# EAGLE design UVBox-I2C (EAGLE 7.5.0)
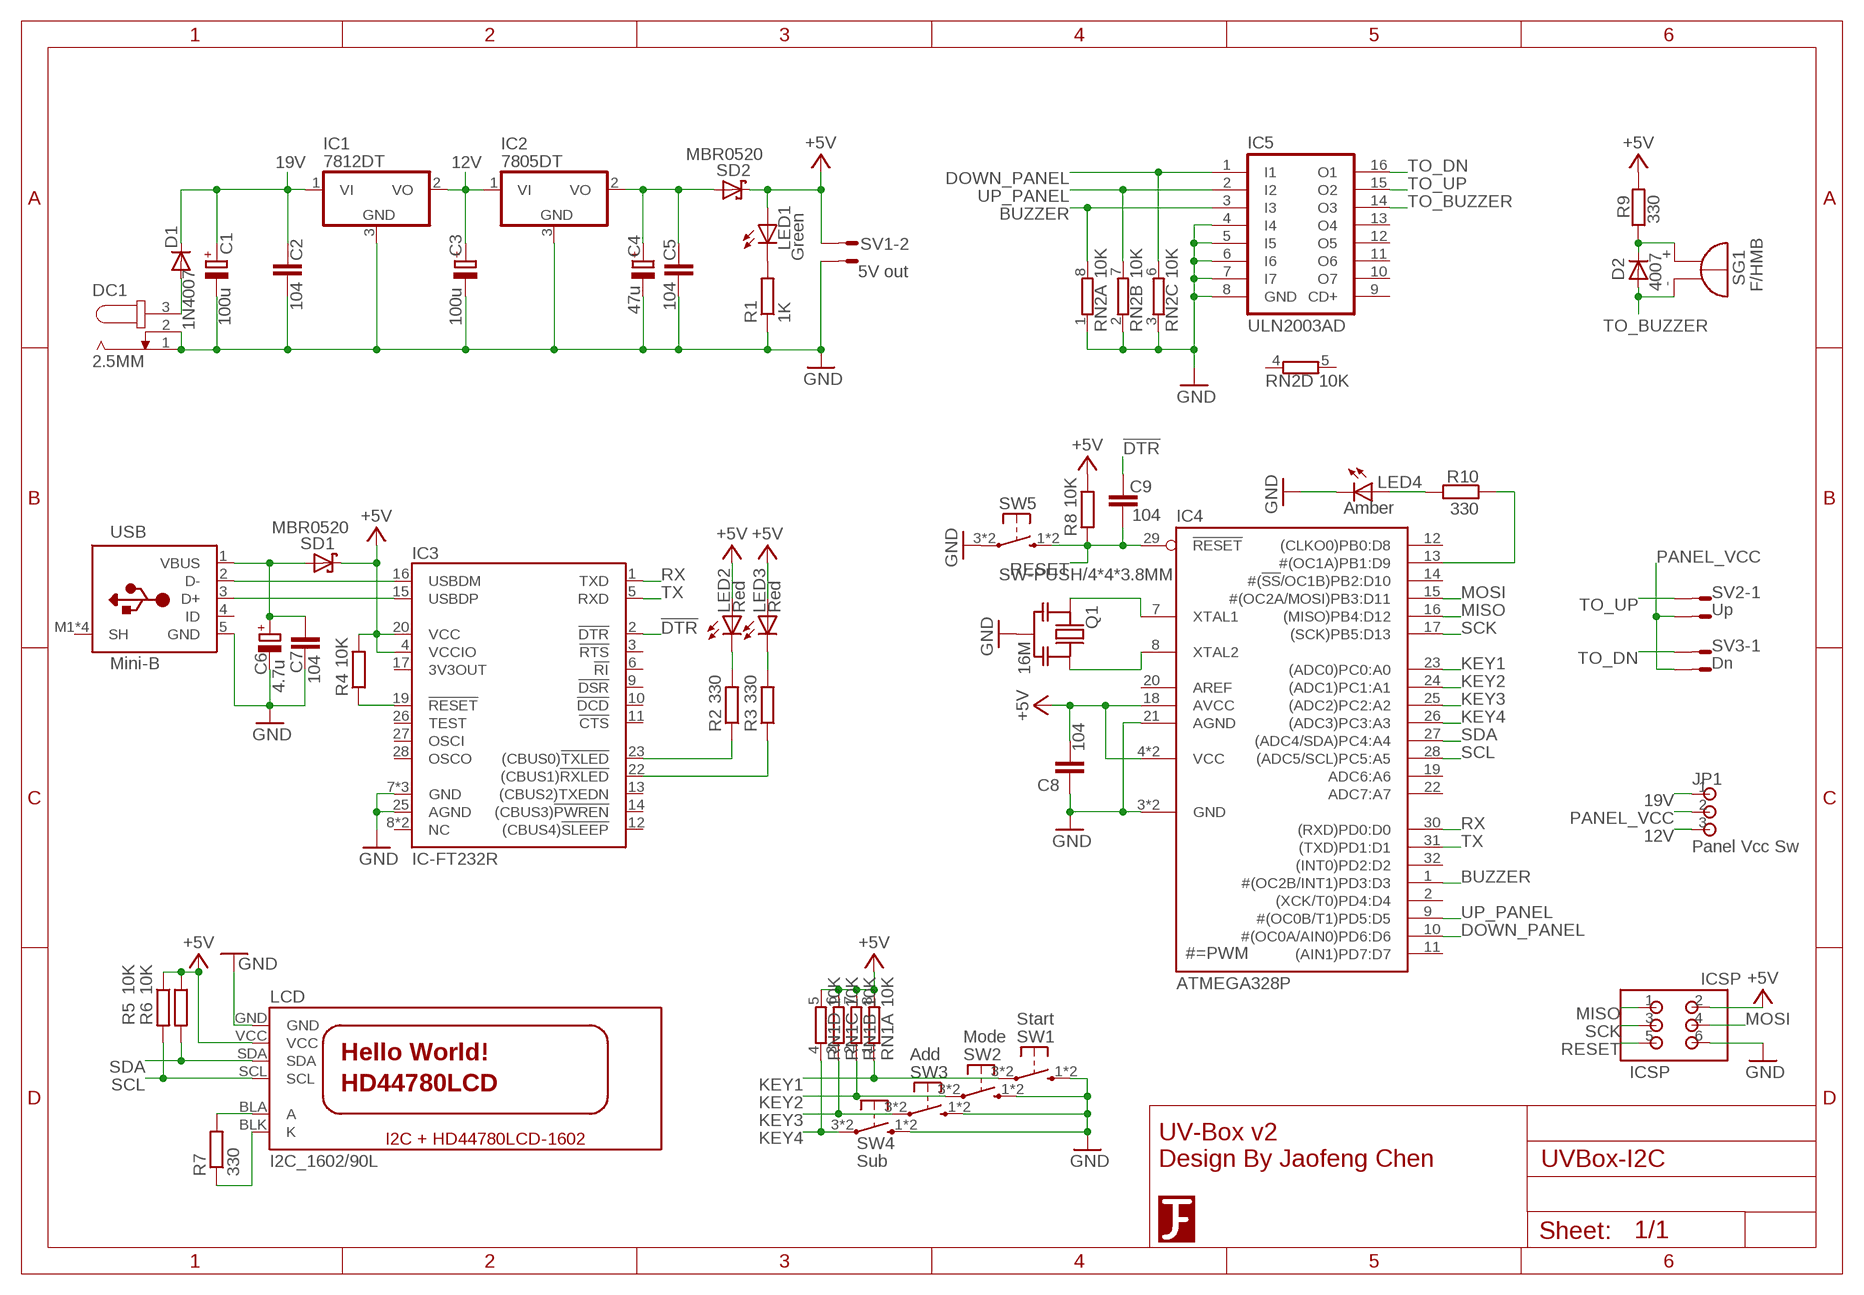
[diagram p0: schematic, sheet 1]

## Parts
C1  100u  CPOL-EU140CLH-0810  [140CLH-0810]
C2  104  C-EUC0805  [C0805]
C3  100u  CPOL-EUSMCC  [SMC_C]
C4  47u  CPOL-EUSMCC  [SMC_C]
C5  104  C-EUC0805  [C0805]
C6  4.7u  CPOL-EUSMCC  [SMC_C]
C7  104  C-EUC0805  [C0805]
C8  104  C-EUC0805  [C0805]
C9  104  C-EUC0805  [C0805]
D1  1N4007  DIODE-DO-214AC  [DO-214AC]
D2  4007  DIODE-DO214AA  [DO214AA]
DC1  2.5MM  DC-JACK/2.5MM  [SPC4078]
IC1  7812DT  [TO252]
IC2  7805DT  [TO252]
IC3  IC-FT232R  [SSOP28]
IC4  ATMEGA328P  ATMEGA328P-TQFP32  [TQFP32]
IC5  ULN2003AD  [SO16]
ICSP  ICSP  PIN-2X3/2.54-DIP  [DIP-2.54-2X3]
JP1  Panel Vcc Sw  PIN-1X3-2.0  [DIP-2.0-1X3]
LCD  I2C_1602/90L  [I2C_1602/90L]
LED1  Green  LEDCHIPLED_1206  [CHIPLED_1206]
LED2  Red  LEDCHIPLED_1206  [CHIPLED_1206]
LED3  Red  LEDCHIPLED_1206  [CHIPLED_1206]
LED4  Amber  LEDCHIPLED_1206  [CHIPLED_1206]
Q1  16M  CERMOSCILL-CSTCE  [CSTCE]
R1  1K  R-EU_R0805  [R0805]
R2  330  R-EU_R0805  [R0805]
R3  330  R-EU_R0805  [R0805]
R4  10K  R-EU_R0805  [R0805]
R5  10K  R-EU_R0805  [R0805]
R6  10K  R-EU_R0805  [R0805]
R7  330  R-EU_R0805  [R0805]
R8  10K  R-EU_R0805  [R0805]
R9  330  R-EU_R0805  [R0805]
R10  330  R-EU_R0805  [R0805]
RN1  10K  RN4R-CAY16  [CAY16]
RN2  10K  RN4R-CAY16  [CAY16]
SD1  MBR0520  SCHOTTKY  [SOD123]
SD2  MBR0520  SCHOTTKY  [SOD123]
SG1  F/HMB  [F/HMB]
SV1  5V out  L02P  [L02P]
SV2  Up  L02P  [L02P]
SV3  Dn  L02P  [L02P]
SW1  Start  SW-PUSH/6*6*3.8MM  [SW-6*6*3.8MM]
SW2  Mode  SW-PUSH/6*6*3.8MM  [SW-6*6*3.8MM]
SW3  Add  SW-PUSH/6*6*3.8MM  [SW-6*6*3.8MM]
SW4  Sub  SW-PUSH/6*6*3.8MM  [SW-6*6*3.8MM]
SW5  SW-PUSH/4*4*3.8MM  [SW-4*4*3.8MM]
U$2  LOGO-3  [LOGO-3]
USB  Mini-B  USB-MINI-B/NO_HOLE  [USB-MINI-B(NO_HOLE)]

## Nets
12V: C3.+ IC1.2(VO) IC2.1(VI) JP1.3
19V: C1.+ C2.1 D1.C IC1.1(VI) JP1.1
!DTR: C9.2 IC3.2(!DTR)
+5V: C8.2 IC3.4(VCCIO) IC3.20(VCC) IC4.4(VCC) IC4.6(VCC) IC4.18(AVCC) ICSP.2 LCD.VCC LED1.A LED2.A LED3.A R4.2 R5.1 R6.1 R8.2 R9.2 RN1.5 RN1.6 RN1.7 RN1.8 SD1.K SD2.K SV1.2
BUZZER: IC4.1(#(OC2B/INT1)PD3:D3) IC5.3(I3) RN2.8
DOWN_PANEL: IC4.10(#(OC0A/AIN0)PD6:D6) IC5.1(I1) RN2.6
GND: C1.- C2.2 C3.- C4.- C5.2 C6.- C7.2 C8.1 DC1.1 DC1.2 IC1.3(GND) IC2.3(GND) IC3.7(GND) IC3.18(GND) IC3.21(GND) IC3.25(AGND) IC4.3(GND) IC4.5(GND) IC4.21(AGND) IC5.4(I4) IC5.5(I5) IC5.6(I6) IC5.7(I7) IC5.8(GND) ICSP.6 LCD.GND LED4.C Q1.2(GND) R1.1 RN2.1 RN2.2 RN2.3 SV1.1 SW1.1(S) SW1.2(S) SW2.1(S) SW2.2(S) SW3.1(S) SW3.2(S) SW4.1(S) SW4.2(S) SW5.3(P) SW5.4(P) USB.5(GND)
KEY1: IC4.23((ADC0)PC0:A0) RN1.1 SW1.3(P) SW1.4(P)
KEY2: IC4.24((ADC1)PC1:A1) RN1.2 SW2.3(P) SW2.4(P)
KEY3: IC4.25((ADC2)PC2:A2) RN1.3 SW3.3(P) SW3.4(P)
KEY4: IC4.26((ADC3)PC3:A3) RN1.4 SW4.3(P) SW4.4(P)
MISO: IC4.16((MISO)PB4:D12) ICSP.1
MOSI: IC4.15(#(OC2A/MOSI)PB3:D11) ICSP.4
N$2: C6.+ C7.1 SD1.A USB.1(VBUS)
N$3: C4.+ C5.1 IC2.2(VO) SD2.A
N$4: D1.A DC1.3
N$5: IC3.19(!RESET) R4.1
N$9: IC4.7(XTAL1) Q1.1(IN)
N$10: LED1.C R1.2
N$11: IC3.16(USBDM) USB.2(D-)
N$12: LCD.BLK(K) R7.1
N$14: LCD.BLA(A) R7.2
N$15: IC3.15(USBDP) USB.3(D+)
N$16: LED2.C R2.2
N$17: LED3.C R3.2
N$18: D2.C R9.1 SG1.+
N$19: IC3.23((CBUS0)!TXLED) R2.1
N$20: IC3.22((CBUS1)!RXLED) R3.1
N$21: LED4.A R10.2
N$22: IC4.13(#(OC1A)PB1:D9) R10.1
N$61: IC4.8(XTAL2) Q1.3(OUT)
PANEL_VCC: JP1.2 SV2.2 SV3.2
RESET: C9.1 IC4.29(!RESET) ICSP.5 R8.1 SW5.1(S) SW5.2(S)
RX: IC3.1(TXD) IC4.30((RXD)PD0:D0)
SCK: IC4.17((SCK)PB5:D13) ICSP.3
SCL: IC4.28((ADC5/SCL)PC5:A5) LCD.SCL R5.2
SDA: IC4.27((ADC4/SDA)PC4:A4) LCD.SDA R6.2
TO_BUZZER: D2.A IC5.14(O3) SG1.-
TO_DN: IC5.16(O1) SV3.1
TO_UP: IC5.15(O2) SV2.1
TX: IC3.5(RXD) IC4.31((TXD)PD1:D1)
UP_PANEL: IC4.9(#(OC0B/T1)PD5:D5) IC5.2(I2) RN2.7
Unconnected: IC3.3(!RTS) IC3.6(!RI) IC3.8(NC) IC3.9(!DSR) IC3.10(!DCD) IC3.11(!CTS) IC3.12((CBUS4)!SLEEP) IC3.13((CBUS2)TXEDN) IC3.14((CBUS3)!PWREN) IC3.17(3V3OUT) IC3.24(NC) IC3.26(TEST) IC3.27(OSCI) IC3.28(OSCO) IC4.2((XCK/T0)PD4:D4) IC4.11((AIN1)PD7:D7) IC4.12((CLKO0)PB0:D8) IC4.14(#(!SS!/OC1B)PB2:D10) IC4.19(ADC6:A6) IC4.20(AREF) IC4.22(ADC7:A7) IC4.32((INT0)PD2:D2) IC5.9(CD+) IC5.10(O7) IC5.11(O6) IC5.12(O5) IC5.13(O4) RN2.4 RN2.5 USB.4(ID) USB.M1(SH) USB.M2(SH) USB.M3(SH) USB.M4(SH)

## Notes on the sheet
- UV-Box v2
  Design By Jaofeng Chen

## Library data of the parts
C1 C3 C4 C6 = rcl:CPOL-EU: POLARIZED CAPACITOR, European symbol
C2 C5 C7-C9 = rcl:C-EU: CAPACITOR, European symbol
D1 D2 = diode:DIODE-: DIODE
DC1 = 0_MyCustom:DC-JACK: DC 電源插座 Power Jack, DC, Right Angle, Through Hole, Rated 5A at 16VDC, PC Terminals Distributor: Farnell (www.Farnell.de) Drawing: 84N1161.pdf / 84N1162.pdf Manufacturer: SPC Technology (www.spctechnology.com) Type: SPC4077(2mm) / SPC 4078(2.5mm)
IC1 IC2 = linear:78*: Positive VOLTAGE REGULATOR Source: http://cache.national.com/ds/LM/LM78L05.pdf http://www.fairchildsemi.com/ds/LM/LM7805.pdf
IC3 = 0_MyCustom:IC-FT232R: FTDI FT232R
IC4 = 0_MyCustom:ATMEGA*-TQFP32: Atmel® AVR® 8-bit Microcontroller with 4/8/16/32KBytes In- System Programmable Flash Device Flash EEPROM RAM Max Speed Power ATmega8 8KBytes 512Bytes 1KBytes 0~16MHz 4.5V~5.5V ATmega8A 8KBytes 512Bytes 1KBytes 0~16MHz 2.7V~5.5V ATmega8L 8KBytes 512Bytes 1KBytes 0~8MHz 2.7V~5.5V ATmega48A 4KBytes 256Bytes 512Bytes 0~20MHz 1.8V~5.5V ATmega48PA 4KBytes 256Bytes 512Bytes 0~20MHz 1.8V~5.5V ATmega88A 8KBytes 512Bytes 1KBytes 0~20MHz 1.8V~5.5V ATmega88PA 8KBytes 512Bytes 1KBytes 0~20MHz 1.8V~5.5V ATmega168A 16KBytes 512Bytes 1KBytes 0~20MHz 1.8V~5.5V ATmega168PA 16KBytes 512Bytes 1KBytes 0~20MHz 1.8V~5.5V ATmega328 32KBytes 1KBytes 2KBytes 0~20MHz 1.8V~5.5V ATmega328P 32KBytes 1KBytes 2KBytes 0~20MHz 1.8V~5.5V
IC5 = uln-udn:ULN2003A: DRIVER ARRAY
ICSP = 0_MyCustom:PIN-2X3
JP1 = 0_MyCustom:PIN-1X3; PIN1: 19v; PIN3: 12v
LCD = 0_MyCustom:I2C_1602: HD44780 1602 + I2C 模組
LED1-LED4 = led:LED: LED OSRAM: - CHIPLED LG R971, LG N971, LY N971, LG Q971, LY Q971, LO R971, LY R971 LH N974, LH R974 LS Q976, LO Q976, LY Q976 LO Q996 - Hyper CHIPLED LW Q18S LB Q993, LB Q99A, LB R99A - SideLED LS A670, LO A670, LY A670, LG A670, LP A670 LB A673, LV A673, LT A673, LW A673 LH A674 LY A675 LS A676, LA A676, LO A676, LY A676, LW A676 LS A679, LY A679, LG A679 - Hyper Micro SIDELED® LS Y876, LA Y876, LO Y876, LY Y876 LT Y87S - SmartLED LW L88C, LW L88S LB L89C, LB L89S, LG L890 LS L89K, LO L89K, LY L89K LS L896, LA L896, LO L896, LY L896 - TOPLED LS T670, LO T670, LY T670, LG T670, LP T670 LSG T670, LSP T670, LSY T670, LOP T670, LYG T670 LG T671, LOG T671, LSG T671 LB T673, LV T673, LT T673, LW T673 LH T674 LS T676, LA T676, LO T676, LY T676, LB T676, LH T676, LSB T676, LW T676 LB T67C, LV T67C, LT T67C, LS T67K, LO T67K, LY T67K, LW E67C LS E67B, LA E67B, LO E67B, LY E67B, LB E67C, LV E67C, LT E67C LW T67C LS T679, LY T679, LG T679 LS T770, LO T770, LY T770, LG T770, LP T770 LB T773, LV T773, LT T773, LW T773 LH T774 LS E675, LA E675, LY E675, LS T675 LS T776, LA T776, LO T776, LY T776, LB T776 LHGB T686 LT T68C, LB T68C - Hyper Mini TOPLED® LB M676 - Mini TOPLED Santana® LG M470 LS M47K, LO M47K, LY M47K Source: http://www.osram.convergy.de LUXEON: - LUMILED® LXK2-PW12-R00, LXK2-PW12-S00, LXK2-PW14-U00, LXK2-PW14-V00 LXK2-PM12-R00, LXK2-PM12-S00, LXK2-PM14-U00 LXK2-PE12-Q00, LXK2-PE12-R00, LXK2-PE12-S00, LXK2-PE14-T00, LXK2-PE14-U00 LXK2-PB12-K00, LXK2-PB12-L00, LXK2-PB12-M00, LXK2-PB14-N00, LXK2-PB14-P00, LXK2-PB14-Q00 LXK2-PR12-L00, LXK2-PR12-M00, LXK2-PR14-Q00, LXK2-PR14-R00 LXK2-PD12-Q00, LXK2-PD12-R00, LXK2-PD12-S00 LXK2-PH12-R00, LXK2-PH12-S00 LXK2-PL12-P00, LXK2-PL12-Q00, LXK2-PL12-R00 Source: www.luxeon.com KINGBRIGHT: KA-3528ASYC Source: www.kingbright.com
Q1 = 0_MyCustom:CERMOSCILL
R1-R10 = rcl:R-EU_: RESISTOR, European symbol
RN1 RN2 = 0_MyCustom:RN4R: B型排阻 8P4R
SD1 SD2 = 0_MyCustom:SCHOTTKY
SG1 = buzzer:F/HMB: BUZZER Source: Buerklin; OC_FARNELL: unknown; OC_NEWARK: unknown
SV1-SV3 = con-amp-mt:L02P: AMP MT CONNECTOR; OC_FARNELL: unknown; OC_NEWARK: unknown
SW1-SW5 = 0_MyCustom:SW-PUSH: 無段式開關
U$2 = 0_MyCustom:LOGO-3
USB = 0_MyCustom:USB-MINI-B

## Net classes
0 default: clearance 0.205 mm

## Board
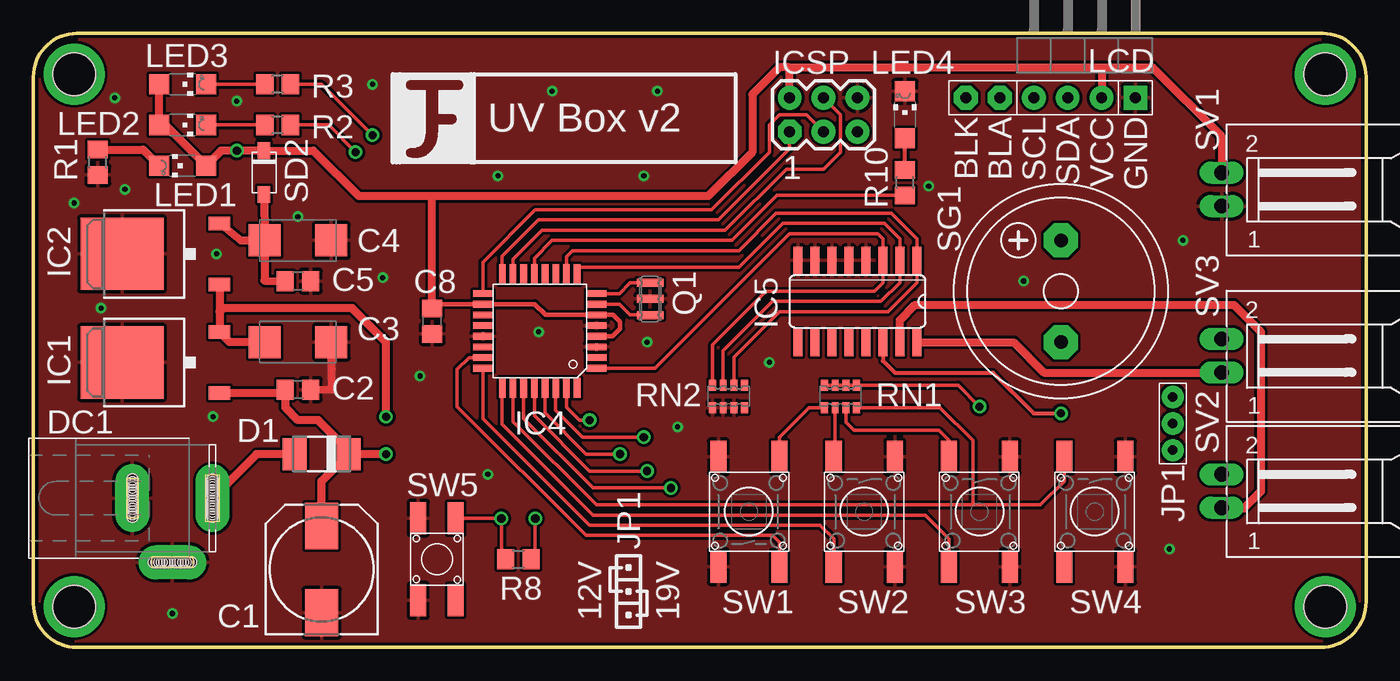
[diagram p1: board, top side]
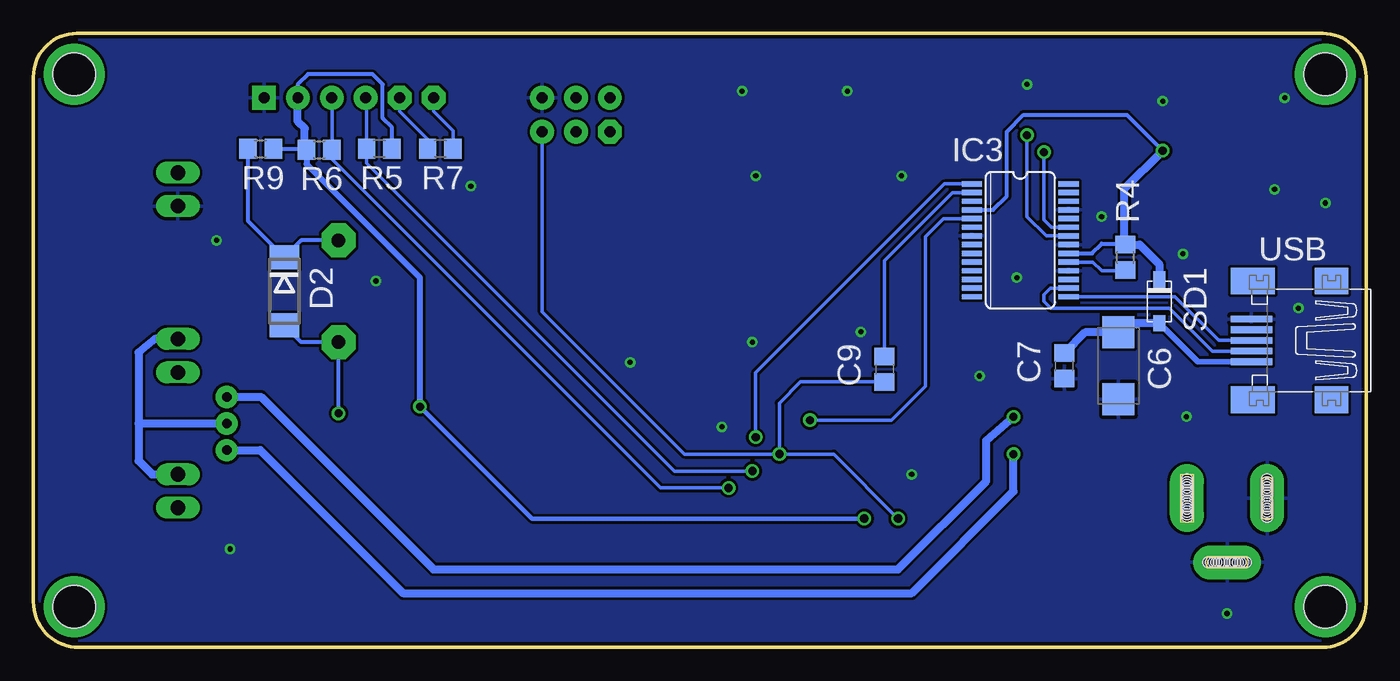
[diagram p2: board, bottom side, seen from below]

Size 99.82 x 45.97 mm. Coordinates in mm from the lower left corner, seen from the top.
Outline: 0,42.72 0,3.25 arc90 3.25,0 96.41,0 arc90 99.82,3.42 99.82,42.72 arc90 96.57,45.97 3.25,45.97 arc90 0,42.72
Copper layers (1*16): Top 0.035mm / dielectric 1.5mm / Bottom 0.035mm
Design rules "default *": minimum track width 10mil, minimum drill 10mil, track to track 8mil, track to pad 8mil, pad to pad 8mil, via to via 8mil, smd to smd 8mil, copper to edge 10mil, drill to drill 8mil, minimum pad ring 10mil, minimum via ring 8mil, stop-mask expansion 4mil, vias tented up to drill 0mil, thermal gap 10mil
Holes 3.2 mm at 3.05,3.05 96.77,3.05 96.77,42.92 3.05,42.92

### Footprints (pad centres in the part's own frame; a part is rotated, then mirrored left to right if it is on the bottom)
140CLH-0810 = smd 3.5 x 2.5: + 3.25,0; - -3.25,0
C0805 = smd 1.3 x 1.5: 1 -0.95,0; 2 0.95,0
SMC_C = smd 2.4 x 2.4: + -2.5,0; - 2.5,0
DO-214AC = smd 1.8 x 2.4: A 2.025,0; C -2.025,0
DO214AA = smd 1.8 x 2.2: A 2.55,0; C -2.55,0
SPC4078 = drill 0.813 pad 2.54 long: 1 -3,0; 2 0,-4.8; 3 3,0 | hole 0.813: -3,1.4; -3,1.2; -3,1; -3,0.8; -3,0.6; -3,0.4; -3,0.2; -3,-1.4; -3,-1.2; -3,-1; -3,-0.8; -3,-0.6; -3,-0.4; -3,-0.2; 3,1.4; 3,1.2; 3,1; 3,0.8; 3,0.6; 3,0.4; 3,0.2; 3,-1.4; 3,-1.2; 3,-1; 3,-0.8; 3,-0.6; 3,-0.4; 3,-0.2; -1.4,-4.8; -1.2,-4.8; -1,-4.8; -0.8,-4.8; -0.6,-4.8; -0.4,-4.8; -0.2,-4.8; 1.4,-4.8; 1.2,-4.8; 1,-4.8; 0.8,-4.8; 0.6,-4.8; 0.4,-4.8; 0.2,-4.8
TO252 = smd 1 x 1.6: 1 -2.28,-4.8; 2 2.28,-4.8 | smd 5.4 x 6.2: 3 0,2.5
SSOP28 = smd 0.4 x 1.5: 1 -4.225,-3.625; 2 -3.575,-3.625; 3 -2.925,-3.625; 4 -2.275,-3.625; 5 -1.625,-3.625; 6 -0.975,-3.625; 7 -0.325,-3.625; 8 0.325,-3.625; 9 0.975,-3.625; 10 1.625,-3.625; 11 2.275,-3.625; 12 2.925,-3.625; 13 3.575,-3.625; 14 4.225,-3.625; 15 4.225,3.625; 16 3.575,3.625; 17 2.925,3.625; 18 2.275,3.625; 19 1.625,3.625; 20 0.975,3.625; 21 0.325,3.625; 22 -0.325,3.625; 23 -0.975,3.625; 24 -1.625,3.625; 25 -2.275,3.625; 26 -2.925,3.625; 27 -3.575,3.625; 28 -4.225,3.625
TQFP32 = smd 1.5 x 0.5: 1 -4.25,2.8; 2 -4.25,2; 3 -4.25,1.2; 4 -4.25,0.4; 5 -4.25,-0.4; 6 -4.25,-1.2; 7 -4.25,-2; 8 -4.25,-2.8; 17 4.25,-2.8; 18 4.25,-2; 19 4.25,-1.2; 20 4.25,-0.4; 21 4.25,0.4; 22 4.25,1.2; 23 4.25,2; 24 4.25,2.8 | smd 0.5 x 1.5: 9 -2.8,-4.25; 10 -2,-4.25; 11 -1.2,-4.25; 12 -0.4,-4.25; 13 0.4,-4.25; 14 1.2,-4.25; 15 2,-4.25; 16 2.8,-4.25; 25 2.8,4.25; 26 2,4.25; 27 1.2,4.25; 28 0.4,4.25; 29 -0.4,4.25; 30 -1.2,4.25; 31 -2,4.25; 32 -2.8,4.25
SO16 = smd 0.66 x 2.032: 1 -4.445,-3.073; 2 -3.175,-3.073; 3 -1.905,-3.073; 4 -0.635,-3.073; 5 0.635,-3.073; 6 1.905,-3.073; 7 3.175,-3.073; 8 4.445,-3.073; 9 4.445,3.073; 10 3.175,3.073; 11 1.905,3.073; 12 0.635,3.073; 13 -0.635,3.073; 14 -1.905,3.073; 15 -3.175,3.073; 16 -4.445,3.073
DIP-2.54-2X3 = drill 0.82 pad 1.778 octagon: 1 -1.27,2.54 | drill 0.82 pad 1.778: 2 1.27,2.54; 3 -1.27,0; 4 1.27,0; 5 -1.27,-2.54; 6 1.27,-2.54
DIP-2.0-1X3 = drill 0.711 pad 1.676: 1 -2,0; 2 0,0; 3 2,0
I2C_1602/90L = drill 0.82 pad 1.778 octagon: BLA 0,-3.81; BLK 0,-6.35 | drill 0.82 pad 1.778 square: GND 0,6.35 | drill 0.82 pad 1.778: SCL 0,-1.27; SDA 0,1.27; VCC 0,3.81
CHIPLED_1206 = smd 1.5 x 1.5: A 0,-1.75; C 0,1.75
CSTCE = smd 0.6 x 2: 1 -1.2,0; 2 0,0; 3 1.2,0
R0805 = smd 1.3 x 1.5: 1 -0.95,0; 2 0.95,0
CAY16 = smd 0.508 x 0.813: 1 -1.2,-0.838; 2 -0.4,-0.838; 3 0.4,-0.838; 4 1.2,-0.838; 5 1.2,0.838; 6 0.4,0.838; 7 -0.4,0.838; 8 -1.2,0.838
SOD123 = smd 1.219 x 0.914: A -1.638,0; K 1.638,0
F/HMB = drill 1.016 pad 2.54 octagon: + 3.81,0; - -3.81,0
L02P = drill 1.1 long: 1 1.25,-6.25; 2 -1.25,-6.25
SW-6*6*3.8MM = smd 2.4 x 1.2: 1 -4.109,2.286; 2 4.109,2.286; 3 -4.109,-2.286; 4 4.109,-2.286
SW-4*4*3.8MM = smd 2.4 x 1.2: 1 -3.076,1.4; 2 3.076,1.4; 3 3.076,-1.4; 4 -3.076,-1.4
USB-MINI-B(NO_HOLE) = smd 3.1 x 0.5: 1 3,1.6; 2 3,0.8; 3 3,0; 4 3,-0.8; 5 3,-1.6 | smd 2.5 x 2: M1 -3,-4.45; M2 -3,4.45 | smd 3.3 x 2: M3 2.9,4.45; M4 2.9,-4.45

### Placement (x,y rotation side)
C1  21.59,5.84 90 top
C2  19.81,19.3 0 top
C3  19.81,22.86 0 top
C4  19.81,30.48 0 top
C5  19.81,27.43 0 top
C6  18.54,21.08 270 bottom
C7  22.61,21.08 270 bottom
C8  29.87,24.43 90 top
C9  36.07,20.83 90 bottom
D1  21.59,14.48 180 top
D2  81.03,26.67 270 bottom
DC1  10.41,11.18 0 top
IC1  9.14,21.34 90 top
IC2  9.14,29.46 90 top
IC3  25.91,30.48 270 bottom
IC4  37.92,23.7 180 top
IC5  61.72,25.91 180 top
ICSP  59.18,39.88 90 top
JP1  85.34,16.76 90 top
LCD  76.2,41.15 270 top
LED1  11.18,36.07 90 top
LED2  11.18,39.12 270 top
LED3  11.18,42.16 270 top
LED4  65.28,39.88 0 top
Q1  46.2,26.09 90 top
R1  4.83,36.32 90 top
R2  18.29,39.12 180 top
R3  18.29,42.16 180 top
R4  18.03,29.21 90 bottom
R5  73.91,37.34 180 bottom
R6  78.41,37.28 0 bottom
R7  69.34,37.34 180 bottom
R8  36.32,6.6 0 top
R9  82.8,37.34 0 bottom
R10  65.28,34.8 90 top
RN1  60.45,18.8 0 top
RN2  52.07,18.8 0 top
SD1  15.49,25.91 90 bottom
SD2  17.27,35.56 90 top
SG1  76.96,26.67 90 top
SV1  95.25,34.29 270 top
SV2  95.25,11.71 270 top
SV3  95.25,21.84 270 top
SW1  53.59,10.16 90 top
SW2  62.23,10.16 270 top
SW3  70.87,10.16 270 top
SW4  79.5,10.16 270 top
SW5  30.23,6.6 270 top
U$2  29.97,39.37 0 top
USB  5.59,22.99 180 bottom

### Tracks (layer width: path | path; a pad name or v marks a point on that pad's centre or on a via)
12V  (via drill 0.6)
  Top 0.61: IC2.1 13.94,25.15 | 13.94,25.15 IC1.2 14.7,22.86 C3.+ | v26.42,17.27 26.42,22.86 23.88,25.4 14.2,25.4 13.94,25.15
  Bottom 0.61: v26.42,17.27 28.45,15.49 28.45,12.45 35.05,5.84 69.85,5.84 82.77,18.76 JP1.3
19V  (via drill 0.6)
  Top 0.61: v26.42,14.48 D1.C | IC1.1 18.61,19.06 C2.1 18.86,17.97 19.81,17.02 21.34,17.02 23.61,14.74 D1.C | 23.62,14.48 D1.C | C1.+ 21.59,12.45 D1.C
  Bottom 0.61: v26.42,14.48 26.42,11.68 34.04,4.06 72.14,4.06 82.84,14.76 JP1.1
!DTR
  Bottom 0.254: IC3.2 30.97,34.05 36.07,28.96 C9.2
+5V  (via drill 0.6, 0.61)
  Top 0.254: RN1.8 RN1.7 RN1.6 RN1.5 69.27,19.63 v70.87,18.03 | 42.21,24.89 IC4.6 | v37.59,9.65 37.59,6.92 R8.2
  Top 0.356: IC4.4 43.36,23.3 43.94,23.88 43.94,24.38 43.43,24.89 42.21,24.89 38.35,24.89 37.55,25.7 IC4.18 30.19,25.7 C8.2
  Top 0.61: 56.64,43.43 80.01,43.43 | 80.01,43.43 83.82,43.43 89,38.25 SV1.2 | 80.01,43.43 LCD.VCC | ICSP.2 56.64,43.43 | 29.72,33.78 50.55,33.78 53.85,37.08 53.85,41.4 55.88,43.43 56.64,43.43 | 29.72,33.78 24.38,33.78 20.97,37.2 SD2.K v15.24,37.2 14.06,37.2 LED1.A 9.43,39.57 LED2.A LED3.A | C8.2 29.87,33.63 29.72,33.78
  Bottom 0.254: 80.01,42.16 LCD.VCC | R6.1 79.44,37.28 79.5,37.34 79.42,37.34 R6.1
  Bottom 0.305: R5.1 72.96,38.93 73.66,39.62 73.66,42.16 74.42,42.93 79.25,42.93 80.01,42.16 | IC3.20 20.53,29.5 19.81,30.23 18.1,30.23 | IC3.4 27.95,32.76 26.92,33.78 26.92,38.61 25.65,39.88 17.92,39.88 v15.24,37.2 | R9.2 79.5,37.34
  Bottom 0.356: v37.59,9.65 62.48,9.65 v70.87,18.03
  Bottom 0.406: 18.1,30.23 R4.2
  Bottom 0.457: R6.1 79.36,36.18 70.87,27.69 v70.87,18.03
  Bottom 0.61: R4.2 16.95,30.16 15.49,28.7 SD1.K | 18.1,30.23 18.1,34.34 v15.24,37.2 | 79.5,37.34 79.5,38.86 80.01,39.37 LCD.VCC
BUZZER
  Top 0.254: RN2.8 50.87,22.68 54.86,26.67 62.99,26.67 63.63,27.3 IC5.3 63.63,30.61 63.25,30.99 56.64,30.99 46.55,20.9 IC4.1
DOWN_PANEL
  Top 0.254: IC4.10 39.92,29.25 40.39,29.72 52.83,29.72 55.63,32.51 64.26,32.51 66.17,30.61 IC5.1 66.17,27.3 64.01,25.15 55.88,25.15 52.47,21.74 RN2.6
GND  (via drill 0.38)
  Top 0.254: 42.18,24.13 IC4.5 | 28.65,3.35 SW5.3 | 6.65,22.85 IC1.3 | 50.79,18.03 RN2.1
  Top 0.356: 30.03,23.32 C8.1
  Top 0.406: IC4.21 33.66,23.32 | 42.09,22.48 42.16,22.48 42.17,22.48 IC4.3 | SW1.2 51.31,14.22 | 51.66,18.14 51.66,17.78 51.67,17.79 RN2.2
  Top 0.61: SW4.2 81.79,6.1 | 73.15,6.1 SW3.2 | 22.93,23.48 C3.- 22.35,22.86 22.35,20.83 22.36,19.32 C2.2 | 7.41,20.57 7,20.98 | 7,20.98 IC1.3 | 21.54,2.54 C1.- | 22.35,30.73 22.35,30.99 C4.- | 7.37,21.34 7,20.98
  Bottom 0.254: IC3.21
  Bottom 0.406: 22.67,20.07 C7.2
  other vias: 28.96,20.32 34.04,12.95 45.97,22.86 48.26,16.51 34.8,35.31 45.72,35.31 85.09,7.37 10.41,2.54 3.05,33.27 13.72,29.46 13.46,17.27 26.16,27.69 19.81,32.26 15.24,40.89 6.1,41.15 6.86,34.29 5.08,25.4 55.12,21.34 74.17,27.43 67.06,34.54 86.11,30.48 46.74,41.66 38.86,41.66 25.4,42.16 37.85,23.62
  pour Top: 99.82,42.72 99.82,3.06 arc-90 96.76,0 3.25,0 arc-90 0,3 0,42.47 arc-90 3.25,45.97 96.57,45.97 arc-90
  pour Bottom: 99.82,42.72 99.82,3.06 arc-90 96.76,0 3.25,0 arc-90 0,2.74 0,42.23 arc-90 3.23,45.97 96.57,45.97 arc-90
KEY1
  Top 0.254: IC4.23 32.62,21.7 31.75,20.83 31.75,18.03 41.4,8.38 55.37,8.38 55.88,7.87 SW1.3 | RN1.1 58.09,17.96 55.88,15.75 SW1.4
KEY2
  Top 0.254: SW2.4 59.94,8.13 58.93,9.14 41.66,9.14 33.67,17.13 IC4.24 | RN1.2 60.05,14.41 SW2.3
KEY3
  Top 0.254: IC4.25 35.12,16.7 41.91,9.91 66.8,9.91 68.58,8.13 SW3.4 | RN1.3 60.85,16.87 61.47,16.26 67.82,16.26 68.58,15.49 SW3.3
KEY4
  Top 0.254: RN1.4 67.89,17.96 70.36,15.49 70.36,10.67 | IC4.26 35.92,16.91 42.16,10.67 70.36,10.67 | 70.36,10.67 75.44,10.67 77.22,12.45 SW4.3
MISO
  Top 0.254: IC4.16 35.12,29.28 37.85,32 51.31,32 56.64,37.34 ICSP.1
MOSI
  Top 0.254: ICSP.4 60.45,39.88 60.45,37.08 59.18,35.81 56.39,35.81 51.82,31.24 38.1,31.24 35.92,29.06 IC4.15
N$2
  Bottom 0.406: 17.85,24.27 C6.+ | USB.1 12.61,21.39 SD1.A
  Bottom 0.61: SD1.A 17.85,24.27 | C6.+ 21.06,23.58 C7.1
N$3
  Top 0.61: SD2.A C4.+ | C4.+ 17.31,27.46 C5.1 | IC2.2 15.54,30.47 C4.+
N$4
  Top 0.61: D1.A 16.72,14.48 DC1.3
N$5
  Bottom 0.254: IC3.19 20.47,28.86 19.81,28.19 18.1,28.19
  Bottom 0.406: 18.1,28.19 R4.1
N$6  (via drill 3.2 pad 4.57)
  other vias: 3.05,42.93
N$7  (via drill 3.2 pad 4.57)
  other vias: 3.05,3.05
N$8  (via drill 3.2 pad 4.57)
  other vias: 96.77,3.05
N$9
  Top 0.254: IC4.7 43.9,25.7 44.7,24.89 Q1.1
N$10
  Top 0.61: R1.2 8.22,37.27 LED1.C
N$11
  Bottom 0.254: IC3.16 23.64,26.91 24.13,26.42 24.13,25.91 23.62,25.4 14.73,25.4 11.52,22.19 USB.2
N$12
  Bottom 0.254: R7.1 68.39,38.67 69.85,40.13 LCD.BLK
N$13  (via drill 3.2 pad 4.57)
  other vias: 96.77,42.93
N$14
  Bottom 0.254: R7.2 70.29,38.03 72.39,40.13 LCD.BLA
N$15
  Bottom 0.254: IC3.15 14.32,26.25 11.05,22.99 USB.3
N$16
  Top 0.254: LED2.C R2.2
N$17
  Top 0.254: LED3.C R3.2
N$18
  Bottom 0.305: R9.1 83.75,31.95 D2.C 79.77,30.48 SG1.+
N$19  (via drill 0.61)
  Top 0.254: v24.13,37.08 22.1,39.12 R2.1
  Bottom 0.254: IC3.23 23.58,31.45 24.13,32 v24.13,37.08
N$20  (via drill 0.61)
  Top 0.254: v25.4,38.35 21.59,42.16 R3.1
  Bottom 0.254: IC3.22 23.95,30.8 25.4,32.26 v25.4,38.35
N$21
  Top 0.305: R10.2 LED4.A
N$22
  Top 0.254: IC4.13 37.52,29.14 38.86,30.48 52.32,30.48 55.69,33.85 R10.1
N$61
  Top 0.254: Q1.3 44.69,27.29 43.9,26.5 IC4.8
PANEL_VCC
  Bottom 0.61: JP1.2 91.95,16.76 | SV3.2 90.7,23.09 91.95,22.1 91.95,16.76 | 91.95,16.76 91.95,13.97 90.93,12.95 SV2.2
RESET  (via drill 0.61)
  Top 0.254: IC4.29 38.32,17.56 41.4,14.48 v43.94,14.48 | 31.65,9.65 SW5.1 35.28,9.68 v35.05,9.65 35.05,6.92 R8.1
  Bottom 0.254: v43.94,14.48 39.88,14.48 v35.05,9.65 | v43.94,14.48 43.94,18.29 42.35,19.88 C9.1 | ICSP.5 61.72,25.15 51.05,14.48 v43.94,14.48
RX  (via drill 0.61)
  Top 0.254: IC4.30 39.12,17.78 41.15,15.75 v45.72,15.75
  Bottom 0.254: IC3.1 31.59,34.7 45.72,20.57 v45.72,15.75
SCK
  Top 0.254: IC4.17 33.67,28.84 37.59,32.77 50.8,32.77 55.12,37.08 55.12,39.12 55.88,39.88 57.91,39.88 ICSP.3
SCL  (via drill 0.61)
  Top 0.254: v45.97,13.21 41.66,13.21 37.52,17.34 IC4.28
  Bottom 0.254: LCD.SCL 74.86,41.08 R5.2 74.86,36.26 51.82,13.21 v45.97,13.21
SDA  (via drill 0.61)
  Top 0.254: IC4.27 36.72,17.13 41.91,11.94 v47.75,11.94
  Bottom 0.254: R6.2 LCD.SDA | 77.47,37.27 R6.2 | v47.75,11.94 52.83,11.94 77.46,36.57 R6.2
TO_BUZZER  (via drill 0.6)
  Top 0.305: IC5.14 63.63,21.46 64.52,20.57 71.88,20.57 74.93,17.53 v76.96,17.53
  Bottom 0.305: D2.A 79.77,22.86 SG1.- v76.96,17.53
TO_DN
  Top 0.61: IC5.16 73.43,22.84 75.69,20.57 88.98,20.57 SV3.1
TO_UP
  Top 0.61: IC5.15 64.9,24.51 66.04,25.65 89.92,25.65 91.95,23.62 91.95,11.68 90.68,10.41 89.05,10.41 SV2.1
TX  (via drill 0.61)
  Top 0.254: v41.66,17.02 40.89,17.02 39.92,17.99 IC4.31
  Bottom 0.254: v41.66,17.02 35.56,17.02 33.02,19.56 33.02,30.73 31.65,32.1 IC3.5
UP_PANEL
  Top 0.254: RN2.7 51.67,22.21 55.37,25.91 63.5,25.91 64.9,27.3 IC5.2 64.9,30.61 63.75,31.75 56.13,31.75 52.84,28.45 40.65,28.45 40.64,28.45 40.64,28.03 IC4.9

### Text on the board
bTest: Besign By Jaofeng Chen / @ 2015/11/11
tSilk: UV Box v2 | 1 | JP1 | 12V | 19V